# Altium project TLM_002_001.PrjPcb (part 1 of 2)
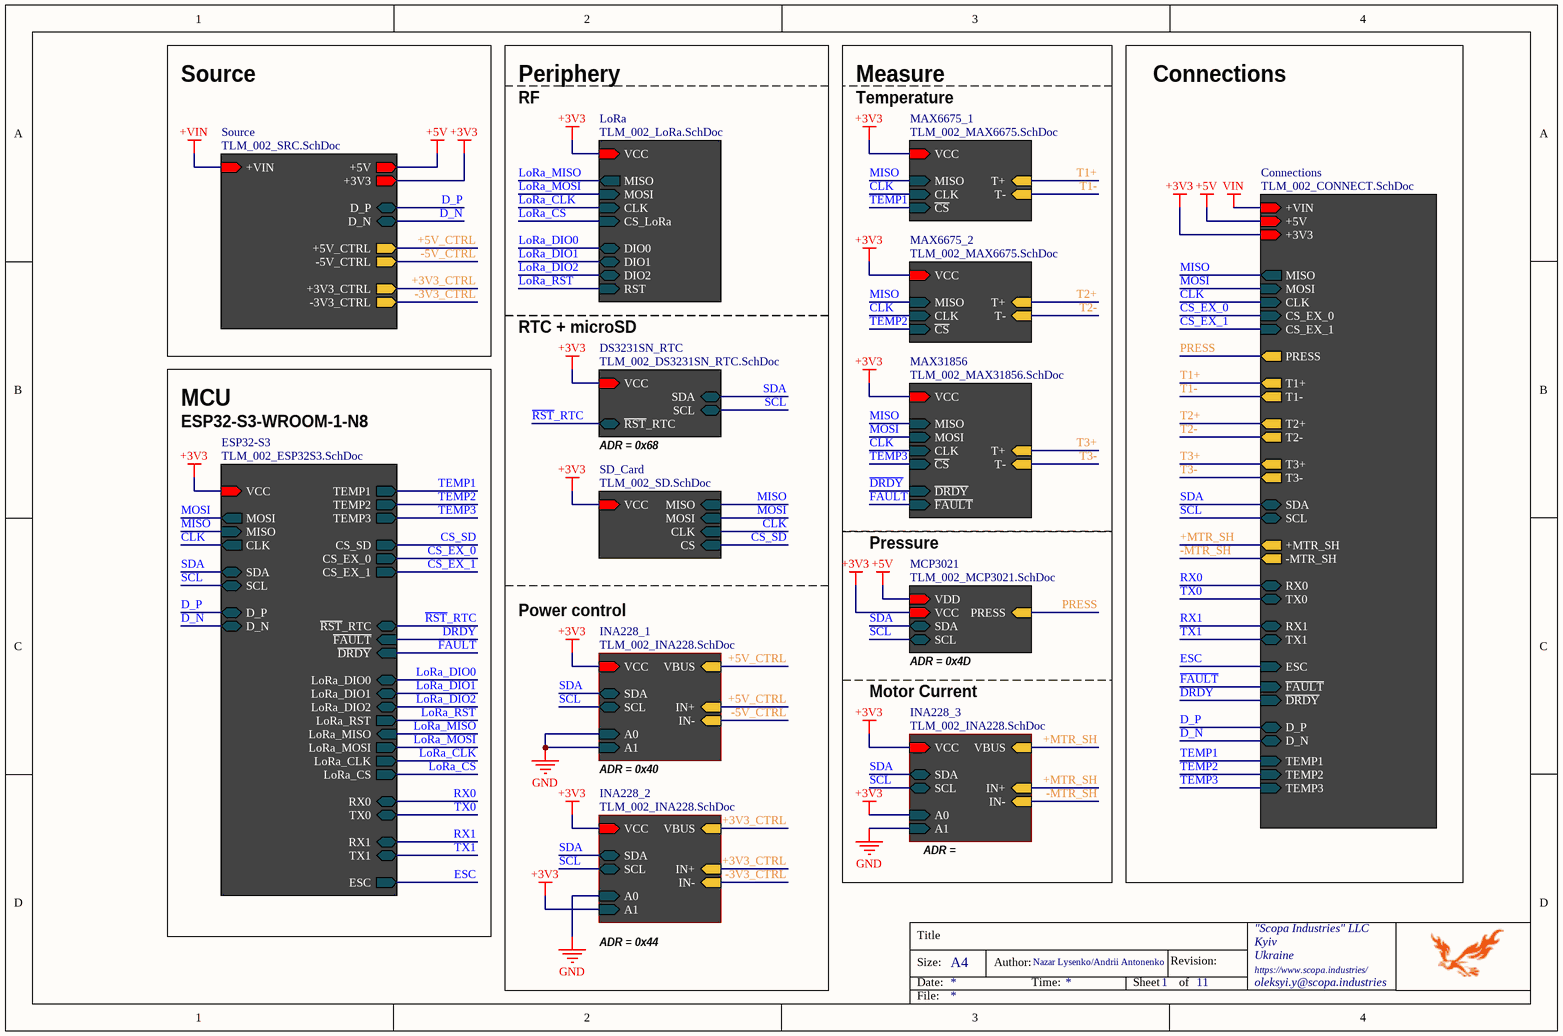
[diagram p0: TLM_002_MBR.SchDoc]
__Project_Template_Version: 1.0.3; _PCB_Order_Accuracy: 0.2mm / 8mil; _PCB_Order_BoardOutlineLayer: Mechanical1 (GM1); _PCB_Order_CastellatedHolesEdges: No; _PCB_Order_Cooper: 1oz / 35um; _PCB_Order_ElectricTest: Necessarily for 100% samples; _PCB_Order_Finish: HASL; _PCB_Order_LayersCnt: 2; _PCB_Order_Mask: on both sides; _PCB_Order_MaskColor: Black / White; _PCB_Order_Material: FR-4; _PCB_Order_MinHole: 0.3 mm; _PCB_Order_Silk: Yes; _PCB_Order_SilkColor: White / Black; _PCB_Order_Size: 0 x 0 mm; _PCB_Order_Thickness: 1.6 mm; Authors: Nazar Lysenko/Andrii Antonenko; Product_Name: TLM_002; Project_ID: 001; Project_Version: 1
11 sheets, 119 parts. Net scope: hierarchical (ports join the sheet entries above them; power ports are global).
Sheets:
  TLM_002_MBR.SchDoc
    MAX6675_1 = TLM_002_MAX6675.SchDoc
    MCP3021 = TLM_002_MCP3021.SchDoc
    INA228_3 = TLM_002_INA228.SchDoc
    ESP32-S3 = TLM_002_ESP32S3.SchDoc
    MAX31856 = TLM_002_MAX31856.SchDoc
    SD_Card = TLM_002_SD.SchDoc
    DS3231SN_RTC = TLM_002_DS3231SN_RTC.SchDoc
    MAX6675_2 = TLM_002_MAX6675.SchDoc
    INA228_2 = TLM_002_INA228.SchDoc
    INA228_1 = TLM_002_INA228.SchDoc
    Source = TLM_002_SRC.SchDoc
    LoRa = TLM_002_LoRa.SchDoc
    Connections = TLM_002_CONNECT.SchDoc

## Sheet TLM_002_MBR.SchDoc: =DocumentName
size A4; Author: Nazar Lysenko/Andrii Antonenko; CompanyName: "Scopa Industries" LLC; Engineer: Nazar Lysenko / Andrii Antonenko; Organization: "Scopa Industries" LLC; Address1: Kyiv; Address2: Ukraine; Address3: https://www.scopa.industries/; Address4: oleksyi.y@scopa.industries; Revision: 1; SheetNumber: 1; SheetTotal: 11

### Sub-sheets
Connections = TLM_002_CONNECT.SchDoc: +VIN (in), +5V (in), +3V3 (in), MISO (out), MOSI (in), CLK (in), CS_EX_0 (in), CS_EX_1 (in), PRESS (out), T1+ (out), T1- (out), T2+ (out), T2- (out), T3+ (out), T3- (out), SDA (bidir), SCL (bidir), +MTR_SH (out), -MTR_SH (out), RX0 (bidir), TX0 (bidir), RX1 (bidir), TX1 (bidir), ESC (in), ~{DRDY} (in), ~{FAULT} (in), D_N (bidir), D_P (bidir), TEMP1 (in), TEMP2 (in), TEMP3 (in)
DS3231SN_RTC = TLM_002_DS3231SN_RTC.SchDoc: VCC (in), SCL (bidir), SDA (bidir), ~{RST}_RTC (bidir)
ESP32-S3 = TLM_002_ESP32S3.SchDoc: MOSI (out), CLK (out), SCL (bidir), SDA (bidir), TEMP3 (out), TEMP2 (out), TEMP1 (out), VCC (in), ~{RST}_RTC (bidir), CS_SD (out), D_N (bidir), TX0 (bidir), RX0 (bidir), D_P (bidir), MISO (in), ~{DRDY} (in), ~{FAULT} (in), LoRa_RST (out), LoRa_DIO0 (bidir), LoRa_DIO1 (bidir), LoRa_DIO2 (bidir), LoRa_MOSI (out), LoRa_CLK (out), LoRa_CS (out), LoRa_MISO (in), TX1 (bidir), RX1 (bidir), ESC (out), CS_EX_1 (out), CS_EX_0 (out)
INA228_1 = TLM_002_INA228.SchDoc: SCL (bidir), SDA (bidir), A1 (in), A0 (in), IN- (in), IN+ (in), VCC (in), VBUS (in)
INA228_2 = TLM_002_INA228.SchDoc: SCL (bidir), SDA (bidir), A1 (in), A0 (in), IN- (in), IN+ (in), VCC (in), VBUS (in)
INA228_3 = TLM_002_INA228.SchDoc: SCL (bidir), SDA (bidir), A1 (in), A0 (in), IN- (in), IN+ (in), VCC (in), VBUS (in)
LoRa = TLM_002_LoRa.SchDoc: VCC (in), MOSI (in), CLK (in), MISO (out), CS_LoRa (in), RST (in), DIO0 (bidir), DIO1 (bidir), DIO2 (bidir)
MAX6675_1 = TLM_002_MAX6675.SchDoc: CLK (in), MISO (in), ~{CS} (in), T+ (in), T- (in), VCC (in)
MAX6675_2 = TLM_002_MAX6675.SchDoc: CLK (in), MISO (in), ~{CS} (in), T+ (in), T- (in), VCC (in)
MAX31856 = TLM_002_MAX31856.SchDoc: VCC (in), CLK (in), MISO (in), ~{CS} (in), MOSI (in), ~{DRDY} (in), ~{FAULT} (in), T+ (in), T- (in)
MCP3021 = TLM_002_MCP3021.SchDoc: SCL (bidir), SDA (bidir), VDD (in), PRESS (in), VCC (in)
SD_Card = TLM_002_SD.SchDoc: VCC (in), CLK (in), CS (in), MISO (in), MOSI (in)
Source = TLM_002_SRC.SchDoc: +VIN (in), D_P (bidir), D_N (bidir), +3V3 (out), +5V (out), -5V_CTRL (out), +5V_CTRL (out), -3V3_CTRL (out), +3V3_CTRL (out)

### Nets
+5V: sheet MCP3021/VDD, sheet INA228_1/IN-, sheet Source/+5V, sheet Source/-5V_CTRL, sheet Connections/+5V  [also labelled -5V_CTRL]
-3V3_CTRL: sheet MAX6675_1/VCC, sheet MCP3021/VCC, sheet INA228_3/A0, sheet INA228_3/VCC, sheet ESP32-S3/VCC, sheet MAX31856/VCC, sheet SD_Card/VCC, sheet DS3231SN_RTC/VCC, sheet MAX6675_2/VCC, sheet INA228_2/A1, sheet INA228_2/IN-, sheet INA228_2/VCC, sheet INA228_1/VCC, sheet Source/+3V3, sheet Source/-3V3_CTRL, sheet LoRa/VCC, sheet Connections/+3V3  [also labelled +3V3]
GND: sheet INA228_3/A1, sheet INA228_2/A0, sheet INA228_1/A1, sheet INA228_1/A0
+3V3_CTRL: sheet INA228_2/IN+, sheet INA228_2/VBUS, sheet Source/+3V3_CTRL
+5V_CTRL: sheet INA228_1/IN+, sheet INA228_1/VBUS, sheet Source/+5V_CTRL
+MTR_SH: sheet INA228_3/IN+, sheet INA228_3/VBUS, sheet Connections/+MTR_SH
-MTR_SH: sheet INA228_3/IN-, sheet Connections/-MTR_SH
CLK: sheet MAX6675_1/CLK, sheet ESP32-S3/CLK, sheet MAX31856/CLK, sheet SD_Card/CLK, sheet MAX6675_2/CLK, sheet Connections/CLK
CS_EX_0: sheet ESP32-S3/CS_EX_0, sheet Connections/CS_EX_0
CS_EX_1: sheet ESP32-S3/CS_EX_1, sheet Connections/CS_EX_1
CS_SD: sheet ESP32-S3/CS_SD, sheet SD_Card/CS
~{DRDY}: sheet ESP32-S3/~{FAULT}, sheet MAX31856/~{DRDY}, sheet Connections/~{DRDY}
D_N: sheet ESP32-S3/D_N, sheet Source/D_N, sheet Connections/D_N
D_P: sheet ESP32-S3/D_P, sheet Source/D_P, sheet Connections/D_P
ESC: sheet ESP32-S3/ESC, sheet Connections/ESC
~{FAULT}: sheet ESP32-S3/~{DRDY}, sheet MAX31856/~{FAULT}, sheet Connections/~{FAULT}
LoRa_CLK: sheet ESP32-S3/LoRa_CLK, sheet LoRa/CLK
LoRa_CS: sheet ESP32-S3/LoRa_CS, sheet LoRa/CS_LoRa
LoRa_DIO0: sheet ESP32-S3/LoRa_DIO0, sheet LoRa/DIO0
LoRa_DIO1: sheet ESP32-S3/LoRa_DIO1, sheet LoRa/DIO1
LoRa_DIO2: sheet ESP32-S3/LoRa_DIO2, sheet LoRa/DIO2
LoRa_MISO: sheet ESP32-S3/LoRa_MISO, sheet LoRa/MISO
LoRa_MOSI: sheet ESP32-S3/LoRa_MOSI, sheet LoRa/MOSI
LoRa_RST: sheet ESP32-S3/LoRa_RST, sheet LoRa/RST
MISO: sheet MAX6675_1/MISO, sheet ESP32-S3/MISO, sheet MAX31856/MISO, sheet SD_Card/MISO, sheet MAX6675_2/MISO, sheet Connections/MISO
MOSI: sheet ESP32-S3/MOSI, sheet MAX31856/MOSI, sheet SD_Card/MOSI, sheet Connections/MOSI
PRESS: sheet MCP3021/PRESS, sheet Connections/PRESS
~{RST}_RTC: sheet ESP32-S3/~{RST}_RTC, sheet DS3231SN_RTC/~{RST}_RTC
RX0: sheet ESP32-S3/RX0, sheet Connections/RX0
RX1: sheet ESP32-S3/RX1, sheet Connections/RX1
SCL: sheet MCP3021/SCL, sheet INA228_3/SCL, sheet ESP32-S3/SCL, sheet DS3231SN_RTC/SCL, sheet INA228_2/SCL, sheet INA228_1/SCL, sheet Connections/SCL
SDA: sheet MCP3021/SDA, sheet INA228_3/SDA, sheet ESP32-S3/SDA, sheet DS3231SN_RTC/SDA, sheet INA228_2/SDA, sheet INA228_1/SDA, sheet Connections/SDA
T1+: sheet MAX6675_1/T+, sheet Connections/T1+
T1-: sheet MAX6675_1/T-, sheet Connections/T1-
T2+: sheet MAX6675_2/T+, sheet Connections/T2+
T2-: sheet MAX6675_2/T-, sheet Connections/T2-
T3+: sheet MAX31856/T+, sheet Connections/T3+
T3-: sheet MAX31856/T-, sheet Connections/T3-
TEMP1: sheet MAX6675_1/~{CS}, sheet ESP32-S3/TEMP1, sheet Connections/TEMP1
TEMP2: sheet ESP32-S3/TEMP2, sheet MAX6675_2/~{CS}, sheet Connections/TEMP2
TEMP3: sheet ESP32-S3/TEMP3, sheet MAX31856/~{CS}, sheet Connections/TEMP3
TX0: sheet ESP32-S3/TX0, sheet Connections/TX0
TX1: sheet ESP32-S3/TX1, sheet Connections/TX1

### Notes on the sheet
- Source
- Periphery
- RF
- Measure
- Temperature
- Connections
- RTC + microSD
- MCU
- ESP32-S3-WROOM-1-N8
- ADR = 0x68
- Pressure
- Power control
- Motor Current
- ADR = 0x4D
- ADR = 0x40
- ADR = 0x41
- ADR = 0x44
- Title
- Size:
- Date:
- A4
- Author:
- Time:
- Sheet
- Revision:
- of
- File:

## Sheet TLM_002_MAX6675.SchDoc: =DocumentName
size A4; CompanyName: Scopa Industries LLC; Engineer: Nazar Lysenko / Andrii Antonenko; Organization: Scopa Industries LLC; Address1: Kyiv; Address2: Ukraine; Address3: https://www.scopa.industries/; Address4: oleksyi.y@scopa.industries; Revision: 1; SheetNumber: 3; SheetTotal: 11
Used 2 times, as channels MAX6675_1, MAX6675_2. Parts and nets are listed once, with the designators drawn on the sheet.
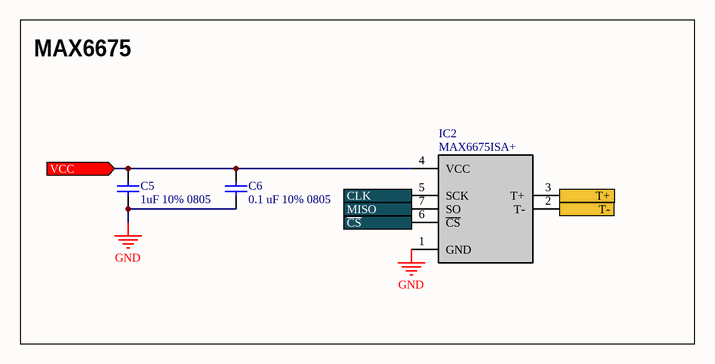
[diagram p1: TLM_002_MAX6675.SchDoc]

### Parts
C5  1uF 10% 0805  [CAPC2013X145X50NL20T20]
C6  0.1 uF 10% 0805  [CAPC2013X140X50ML20T25]
IC2  MAX6675ISA+  [SOIC127P600X175-8N]

### Ports
CLK (in, see TLM_002_MBR[3A], TLM_002_CONNECT[1B], TLM_002_ESP32S3[2B], TLM_002_MAX31856[2B], TLM_002_SD[3B]), MISO (out, see TLM_002_MBR[3A], TLM_002_CONNECT[1A], TLM_002_ESP32S3[3B], TLM_002_MAX31856[2B], TLM_002_SD[3B]), T+ (in, see TLM_002_MBR[3A]), T- (in, see TLM_002_MBR[3A]), VCC (in, see TLM_002_MBR[3A], TLM_002_DS3231SN_RTC[2B], TLM_002_ESP32S3[1A], TLM_002_INA228[1B], TLM_002_LoRa[2B], TLM_002_MAX31856[1B], TLM_002_SD[1B]), ~{CS} (in, see TLM_002_MBR[3A])

### Nets
GND: C5.1 C6.1 IC2.1(GND)
~{CS}: IC2.6(~{CS}) ; port ~{CS}
CLK: IC2.5(SCK) ; port CLK
MISO: IC2.7(SO) ; port MISO
T+: IC2.3(T+) ; port T+
T-: IC2.2(T-) ; port T-
VCC: C5.2 C6.2 IC2.4(VCC) ; port VCC

### Channels
MAX6675_1: designators end in _MAX6675_1; ports CLK=CLK MISO=MISO T+=T1+ T-=T1- VCC=-3V3_CTRL ~{CS}=TEMP1
MAX6675_2: designators end in _MAX6675_2; ports CLK=CLK MISO=MISO T+=T2+ T-=T2- VCC=-3V3_CTRL ~{CS}=TEMP2

### Notes on the sheet
- MAX6675
- Title
- Size:
- Date:
- A4
- Author:
- Time:
- Sheet
- Revision:
- of
- File:

### Library data of the parts
C5 = CMP-2007-01676-1: Part Number: VJ0805Y105KXQRW1BC; Manufacturer: Vitramon
C6 = CMP-2007-04651-1: Part Number: 0805DD104KAT2A; Manufacturer: AVX Interconnect / Elco
IC2 = MAX6675ISA+: Integrated Circuit; Manufacturer_Name: Analog Devices; Datasheet Link: http://datasheets.maximintegrated.com/en/ds/MAX6675.pdf; Height: 1.75mm; Manufacturer_Part_Number: MAX6675ISA+; Mouser Part Number: 700-MAX6675ISA; Mouser Price/Stock: https://www.mouser.co.uk/ProductDetail/Analog-Devices-Maxim-Integrated/MAX6675ISA%2b?qs=1THa7WoU59H74vpgspkIMw%3D%3D; Arrow Part Number: MAX6675ISA+; Arrow Price/Stock: https://www.arrow.com/en/products/max6675isa/analog-devices?utm_currency=USD&region=nac

## Sheet TLM_002_MCP3021.SchDoc: =DocumentName
size A4; Author: Nazar Lysenko/Andrii Antonenko; CompanyName: Scopa Industries LLC; Engineer: Nazar Lysenko / Andrii Antonenko; Organization: Scopa Industries LLC; Address1: Kyiv; Address2: Ukraine; Address3: https://www.scopa.industries/; Address4: oleksyi.y@scopa.industries; Revision: 1; SheetNumber: 8; SheetTotal: 11
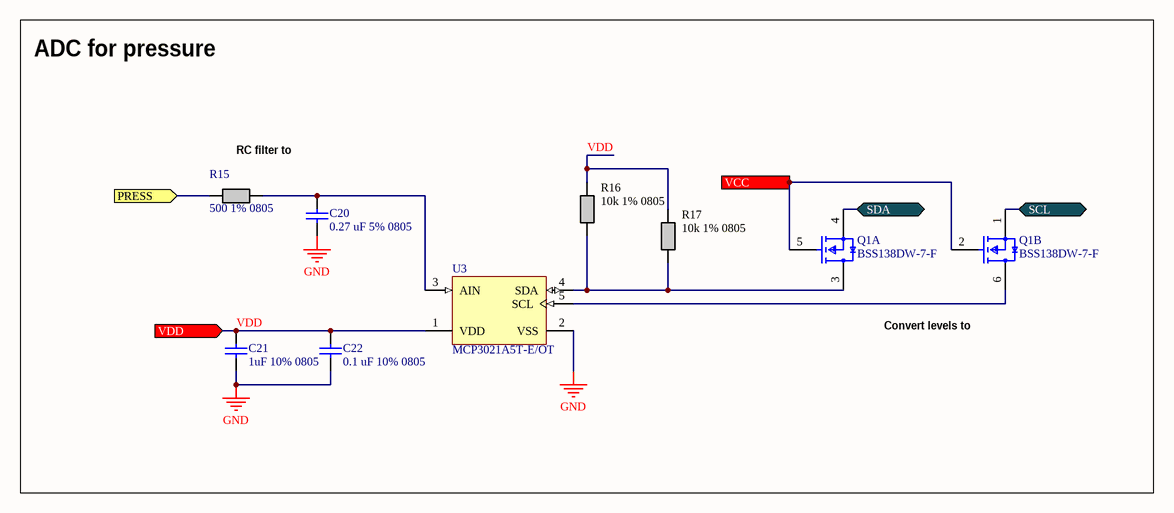
[diagram p2: TLM_002_MCP3021.SchDoc]

### Parts
C20  0.27 uF 5% 0805  [CAPC2013X145X50ML20T20]
C21  1uF 10% 0805  [CAPC2013X145X50NL20T20]
C22  0.1 uF 10% 0805  [CAPC2013X140X50ML20T25]
Q1  BSS138DW-7-F  [FP-SOT363-IPC_B]  (parts A,B of 2)
R15  500 1% 0805  [RES_0805]
R16  10k 1% 0805  [RES_0805]
R17  10k 1% 0805  [RES_0805]
U3  MCP3021A5T-E/OT  [SOT-23-OT5_L]

### Ports
PRESS (in, see TLM_002_MBR[3C], TLM_002_CONNECT[1C]), SCL (bidir, see TLM_002_MBR[3C], TLM_002_CONNECT[1B], TLM_002_DS3231SN_RTC[2B], TLM_002_ESP32S3[2B], TLM_002_INA228[2B]), SDA (bidir, see TLM_002_MBR[3C], TLM_002_CONNECT[1B], TLM_002_DS3231SN_RTC[2B], TLM_002_ESP32S3[2B], TLM_002_INA228[2B]), VCC (in, see TLM_002_MBR[3C], TLM_002_DS3231SN_RTC[2B], TLM_002_ESP32S3[1A], TLM_002_INA228[1B], TLM_002_LoRa[2B], TLM_002_MAX6675[2B], TLM_002_MAX31856[1B], TLM_002_SD[1B]), VDD (in, see TLM_002_MBR[3C])

### Nets
-3V3_CTRL: Q1.2(G2) Q1.5(G1) ; port VCC
GND: C20.1 C21.1 C22.1 U3.2(VSS)
VDD: C21.2 C22.2 R16.1 R17.1 U3.1(VDD) ; port VDD  [project net +5V]
PRESS: R15.1 ; port PRESS
SCL: Q1.1(S2) ; port SCL
SDA: Q1.4(S1) ; port SDA
NetC20_2: C20.2 R15.2 U3.3(AIN)
NetQ1_3: Q1.3(D1) R16.2 R17.2 U3.4(SDA)
NetQ1_6: Q1.6(D2) U3.5(SCL)

### Notes on the sheet
- ADC for pressure sensor
- RC filter to 1kHz
- Convert levels to 3V3
- Title
- Size:
- Date:
- A4
- Author:
- Time:
- Sheet
- Revision:
- of
- File:

### Library data of the parts
C20 = CMP-2007-01595-1: Part Number: VJ0805Y274JXXTW1BC; Manufacturer: Vitramon
C21 = CMP-2007-01676-1: as C5 on sheet TLM_002_MAX6675
C22 = CMP-2007-04651-1: as C6 on sheet TLM_002_MAX6675
Q1 = CMP-2000-05966-3: MOSFET 2N-CH 50V 0.2A SC70-6; Drain to Source Resistance: 3.5R; Current Rating: 200mA; Number of Channels: 2; Element Configuration: Dual; Threshold Voltage: 1.2V; Power Dissipation: 200mW; Turn-On Delay Time: 20ns; FET Type: 2 N-Channel; Gate to Source Voltage (Vgs): 20V; Input Capacitance: 50pF; Max Operating Temperature: 150°C; Number of Terminals: 6; Mount: Surface Mount; Number of Pins: 6; Packaging: Tape and Reel; Min Breakdown Voltage: 50V; REACH SVHC: No SVHC; Contact Plating: Tin; Min Operating Temperature: -55°C; Drain to Source Voltage (Vdss): 50V; Case/Package: SOT-363; On-State Resistance: 3.5R; Height: 1mm; Continuous Drain Current (ID): 200mA; Turn-Off Delay Time: 20ns; Lead Free: Lead Free; Number of Elements: 2; Max Power Dissipation: 200mW; Width: 1.35mm; Package Quantity: 3000; Length: 2.2mm; Drain to Source Breakdown Voltage: 50V; Voltage Rating (DC): 50V; Nominal Vgs: 1.2V; Rds On Max: 3.5R; Weight: 0.000212oz
R15 = Resistor_500: Resistor 500Ohm 1% SMD 0805 Generic; Value: 500; Package size: 0805; Tolerance: 1%
R16 R17 = Resistor_10k: Resistor 10kOhm 1% SMD 0805 Generic; Package size: 0805; Tolerance: 1%; Value: 10k
U3 = CMP-0188-00725-2: Low Power 10-Bit A/D Converter With I2C Interface, 5-Pin SOT-23, Extended Temperature, Tape and Reel; PackageVersion: revBB, Aug-2009; ComponentLink1Description: Manufacturer URL; PackageReference: SOT-23-OT5; DatasheetVersion: revA, May-2003; RevisionNote: URLs added.; ComponentLink2URL: http://ww1.microchip.com/downloads/en/DeviceDoc/21805a.pdf; Code_IPC: SOT23-5; ComponentLink1URL: http://www.microchip.com/; ComponentLink3URL: http://www.microchip.com/stellent/groups/techpub_sg/documents/packagingspec/en012702.pdf; ComponentLink3Description: Package Specification; PackageDescription: 5-Lead Plastic Small Outline Transistor (OT) [SOT-23]; ComponentLink2Description: Datasheet

## Sheet TLM_002_INA228.SchDoc: =DocumentName
size A4; Author: Nazar Lysenko/Andrii Antonenko; CompanyName: Scopa Industries LLC; Engineer: Nazar Lysenko / Andrii Antonenko; Organization: Scopa Industries LLC; Address1: Kyiv; Address2: Ukraine; Address3: https://www.scopa.industries/; Address4: oleksyi.y@scopa.industries; Revision: 1; SheetNumber: 5; SheetTotal: 11
Used 3 times, as channels INA228_3, INA228_2, INA228_1. Parts and nets are listed once, with the designators drawn on the sheet.
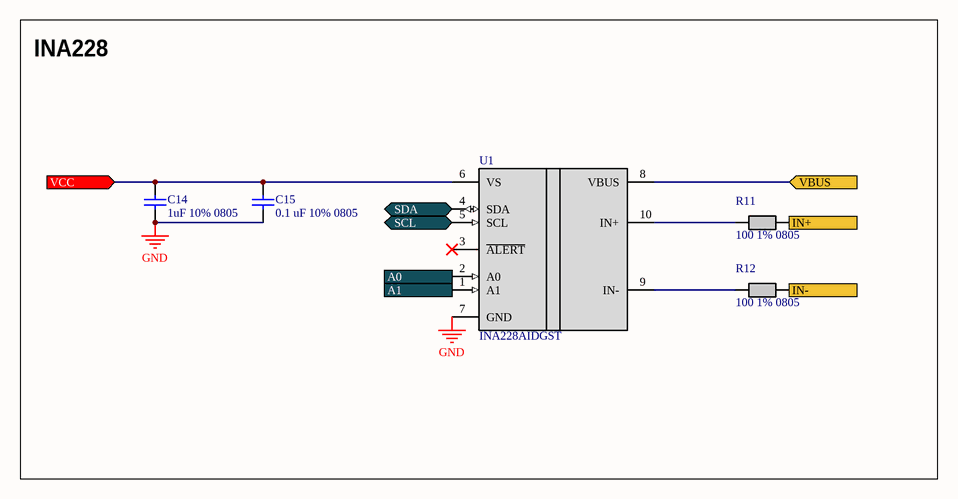
[diagram p3: TLM_002_INA228.SchDoc]

### Parts
C14  1uF 10% 0805  [CAPC2013X145X50NL20T20]
C15  0.1 uF 10% 0805  [CAPC2013X140X50ML20T25]
R11  100 1% 0805  [RES_0805]
R12  100 1% 0805  [RES_0805]
U1  INA228AIDGST  [FP-DGS0010A-IPC_C]

### Ports
A0 (in, see TLM_002_MBR[2C]), A1 (in, see TLM_002_MBR[2C]), IN+ (in, see TLM_002_MBR[2C]), IN- (in, see TLM_002_MBR[2C]), SCL (bidir, see TLM_002_MBR[2C], TLM_002_CONNECT[1B], TLM_002_DS3231SN_RTC[2B], TLM_002_ESP32S3[2B], TLM_002_MCP3021[4B]), SDA (bidir, see TLM_002_MBR[2C], TLM_002_CONNECT[1B], TLM_002_DS3231SN_RTC[2B], TLM_002_ESP32S3[2B], TLM_002_MCP3021[3B]), VBUS (in, see TLM_002_MBR[2C]), VCC (in, see TLM_002_MBR[2C], TLM_002_DS3231SN_RTC[2B], TLM_002_ESP32S3[1A], TLM_002_LoRa[2B], TLM_002_MAX6675[2B], TLM_002_MAX31856[1B], TLM_002_MCP3021[3B], TLM_002_SD[1B])

### Nets
GND: C14.1 C15.1 U1.7(GND)
A0: U1.2(A0) ; port A0
A1: U1.1(A1) ; port A1
IN+: R11.2 ; port IN+
IN-: R12.2 ; port IN-
SCL: U1.5(SCL) ; port SCL
SDA: U1.4(SDA) ; port SDA
VBUS: U1.8(VBUS) ; port VBUS
VCC: C14.2 C15.2 U1.6(VS) ; port VCC
NetR11_1: R11.1 U1.10(IN+)
NetR12_1: R12.1 U1.9(IN-)

Not connected (* = marked no-connect by the designer): U1 3(~{ALERT})*

### Channels
INA228_3: designators end in _INA228_3; ports A0=-3V3_CTRL A1=GND IN+=+MTR_SH IN-=-MTR_SH SCL=SCL SDA=SDA VBUS=+MTR_SH VCC=-3V3_CTRL
INA228_2: designators end in _INA228_2; ports A0=GND A1=-3V3_CTRL IN+=+3V3_CTRL IN-=-3V3_CTRL SCL=SCL SDA=SDA VBUS=+3V3_CTRL VCC=-3V3_CTRL
INA228_1: designators end in _INA228_1; ports A0=GND A1=GND IN+=+5V_CTRL IN-=+5V SCL=SCL SDA=SDA VBUS=+5V_CTRL VCC=-3V3_CTRL

### Notes on the sheet
- INA228
- Title
- Size:
- Date:
- A4
- Author:
- Time:
- Sheet
- Revision:
- of
- File:

### Library data of the parts
C14 = CMP-2007-01676-1: as C5 on sheet TLM_002_MAX6675
C15 = CMP-2007-04651-1: as C6 on sheet TLM_002_MAX6675
R11 R12 = Resistor_100: Resistor 100Ohm 1% SMD 0805 Generic; Value: 100; Package size: 0805; Tolerance: 1%
U1 = CMP-019-00049-1: IC PWR MONITOR 10VSSOP Power Supply Controller Digital Power Monitor 10-VSSOP

## Sheet TLM_002_ESP32S3.SchDoc: =DocumentName
size A4; Author: Nazar Lysenko/Andrii Antonenko; CompanyName: Scopa Industries LLC; Engineer: Nazar Lysenko / Andrii Antonenko; Organization: Scopa Industries LLC; Address1: Kyiv; Address2: Ukraine; Address3: https://www.scopa.industries/; Address4: oleksyi.y@scopa.industries; Revision: 1; SheetNumber: 2; SheetTotal: 11
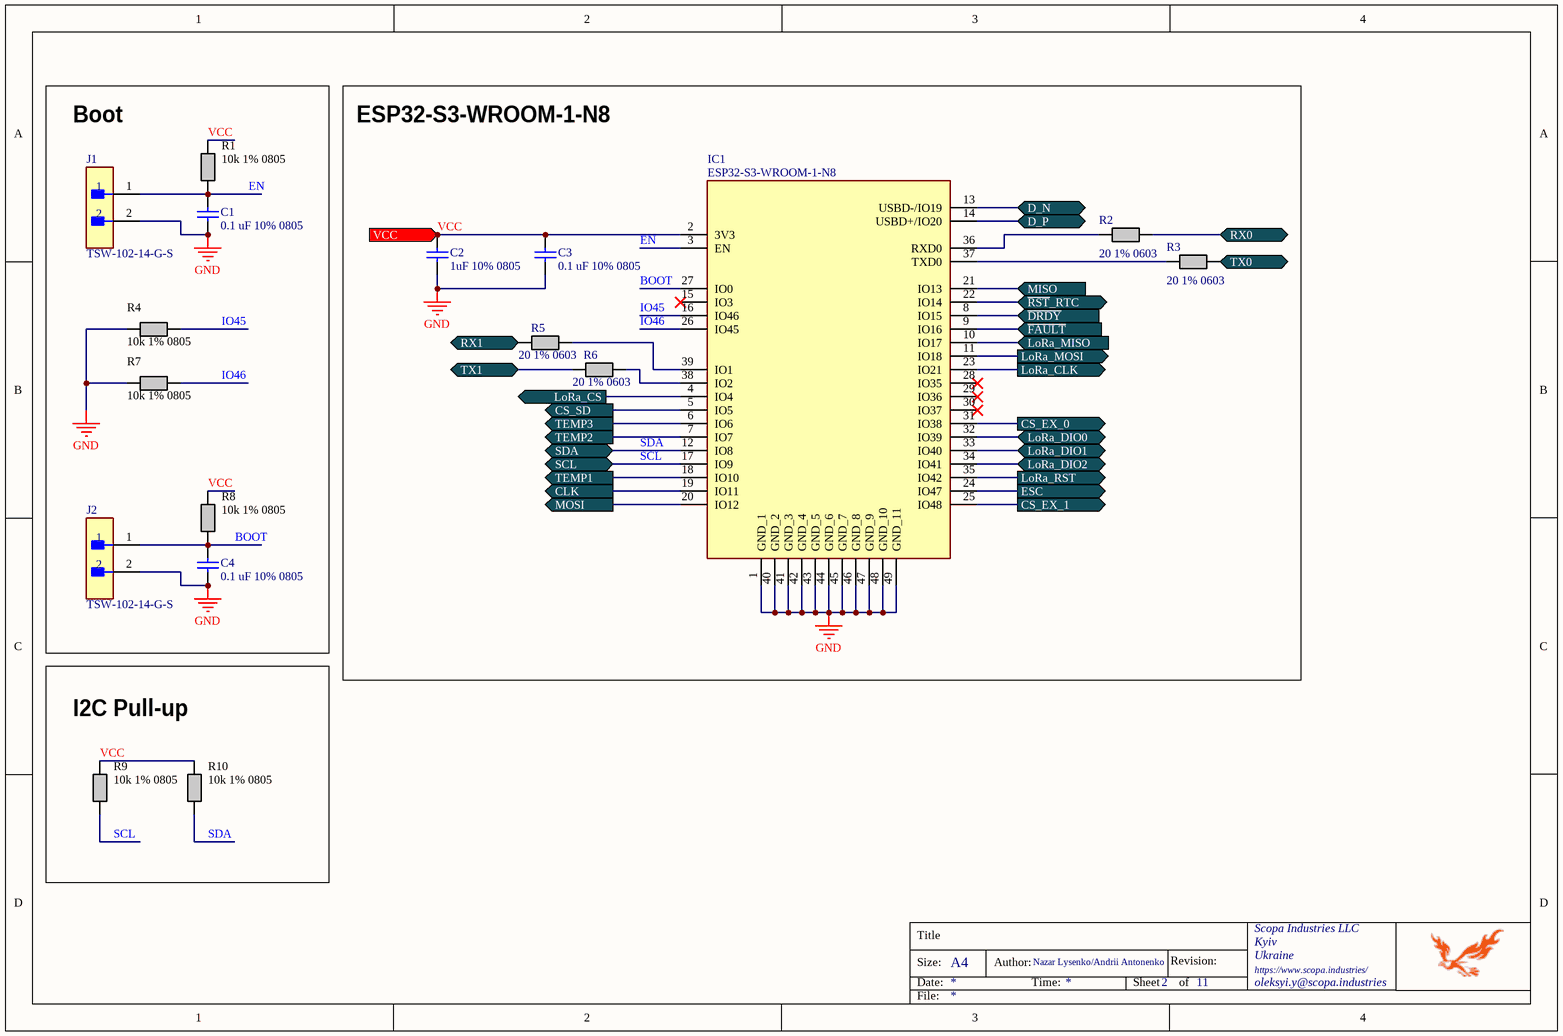
[diagram p4: TLM_002_ESP32S3.SchDoc]

### Parts
C1  0.1 uF 10% 0805  [CAPC2013X140X50ML20T25]
C2  1uF 10% 0805  [CAPC2013X145X50NL20T20]
C3  0.1 uF 10% 0805  [CAPC2013X140X50ML20T25]
C4  0.1 uF 10% 0805  [CAPC2013X140X50ML20T25]
IC1  ESP32-S3-WROOM-1-N8  [ESP32S3WROOM1N8R2]
J1  TSW-102-14-G-S  [FP-TSW-102-14-G-S-MFG]
J2  TSW-102-14-G-S  [FP-TSW-102-14-G-S-MFG]
R1  10k 1% 0805  [RES_0805]
R2  20 1% 0603  [RES_0603]
R3  20 1% 0603  [RES_0603]
R4  10k 1% 0805  [RES_0805]
R5  20 1% 0603  [RES_0603]
R6  20 1% 0603  [RES_0603]
R7  10k 1% 0805  [RES_0805]
R8  10k 1% 0805  [RES_0805]
R9  10k 1% 0805  [RES_0805]
R10  10k 1% 0805  [RES_0805]

### Ports
CLK (out, see TLM_002_MBR[1C], TLM_002_CONNECT[1B], TLM_002_MAX6675[2B], TLM_002_MAX31856[2B], TLM_002_SD[3B]), CS_EX_0 (out, see TLM_002_MBR[2C], TLM_002_CONNECT[1B]), CS_EX_1 (out, see TLM_002_MBR[2C], TLM_002_CONNECT[1B]), CS_SD (out, see TLM_002_MBR[2C]), D_N (bidir, see TLM_002_MBR[1C], TLM_002_CONNECT[1B], TLM_002_SRC[2C]), D_P (bidir, see TLM_002_MBR[1C], TLM_002_CONNECT[1B], TLM_002_SRC[2C]), ESC (out, see TLM_002_MBR[2D], TLM_002_CONNECT[4A]), LoRa_CLK (out, see TLM_002_MBR[2C]), LoRa_CS (out, see TLM_002_MBR[2D]), LoRa_DIO0 (bidir, see TLM_002_MBR[2C]), LoRa_DIO1 (bidir, see TLM_002_MBR[2C]), LoRa_DIO2 (bidir, see TLM_002_MBR[2C]), LoRa_MISO (in, see TLM_002_MBR[2C]), LoRa_MOSI (out, see TLM_002_MBR[2C]), LoRa_RST (out, see TLM_002_MBR[2C]), MISO (in, see TLM_002_MBR[1C], TLM_002_CONNECT[1A], TLM_002_MAX6675[2B], TLM_002_MAX31856[2B], TLM_002_SD[3B]), MOSI (out, see TLM_002_MBR[1C], TLM_002_CONNECT[1A], TLM_002_MAX31856[2B], TLM_002_SD[3B]), RX0 (bidir, see TLM_002_MBR[2D], TLM_002_CONNECT[1B]), RX1 (bidir, see TLM_002_MBR[2D], TLM_002_CONNECT[1B]), SCL (bidir, see TLM_002_MBR[1C], TLM_002_CONNECT[1B], TLM_002_DS3231SN_RTC[2B], TLM_002_INA228[2B], TLM_002_MCP3021[4B]), SDA (bidir, see TLM_002_MBR[1C], TLM_002_CONNECT[1B], TLM_002_DS3231SN_RTC[2B], TLM_002_INA228[2B], TLM_002_MCP3021[3B]), TEMP1 (out, see TLM_002_MBR[2B], TLM_002_CONNECT[1B]), TEMP2 (out, see TLM_002_MBR[2B], TLM_002_CONNECT[1B]), TEMP3 (out, see TLM_002_MBR[2C], TLM_002_CONNECT[1B]), TX0 (bidir, see TLM_002_MBR[2D], TLM_002_CONNECT[1B]), TX1 (bidir, see TLM_002_MBR[2D], TLM_002_CONNECT[1B]), VCC (in, see TLM_002_MBR[1B], TLM_002_DS3231SN_RTC[2B], TLM_002_INA228[1B], TLM_002_LoRa[2B], TLM_002_MAX6675[2B], TLM_002_MAX31856[1B], TLM_002_MCP3021[3B], TLM_002_SD[1B]), ~{DRDY} (in, see TLM_002_MBR[2C]), ~{FAULT} (in, see TLM_002_MBR[2C]), ~{RST}_RTC (bidir, see TLM_002_MBR[2C], TLM_002_DS3231SN_RTC[3B])

### Nets
GND: C1.1 C2.1 C3.1 C4.1 IC1.1(GND_1) IC1.40(GND_2) IC1.41(GND_3) IC1.42(GND_4) IC1.43(GND_5) IC1.44(GND_6) IC1.45(GND_7) IC1.46(GND_8) IC1.47(GND_9) IC1.48(GND_10) IC1.49(GND_11) J1.2 J2.2 R4.1 R7.1
VCC: C2.2 C3.2 IC1.2(3V3) R1.1 R8.1 R9.1 R10.1 ; port VCC  [project net -3V3_CTRL]
BOOT: C4.2 IC1.27(IO0) J2.1 R8.2
CLK: IC1.19(IO11) ; port CLK
CS_EX_0: IC1.31(IO38) ; port CS_EX_0
CS_EX_1: IC1.25(IO48) ; port CS_EX_1
CS_SD: IC1.5(IO5) ; port CS_SD
~{DRDY}: IC1.9(IO16) ; port ~{FAULT}
D_N: IC1.13(USBD-/IO19) ; port D_N
D_P: IC1.14(USBD+/IO20) ; port D_P
EN: C1.2 IC1.3(EN) J1.1 R1.2
ESC: IC1.24(IO47) ; port ESC
~{FAULT}: IC1.8(IO15) ; port ~{DRDY}
IO45: IC1.16(IO46) R4.2
IO46: IC1.26(IO45) R7.2
LoRa_CLK: IC1.23(IO21) ; port LoRa_CLK
LoRa_CS: IC1.4(IO4) ; port LoRa_CS
LoRa_DIO0: IC1.32(IO39) ; port LoRa_DIO0
LoRa_DIO1: IC1.33(IO40) ; port LoRa_DIO1
LoRa_DIO2: IC1.34(IO41) ; port LoRa_DIO2
LoRa_MISO: IC1.10(IO17) ; port LoRa_MISO
LoRa_MOSI: IC1.11(IO18) ; port LoRa_MOSI
LoRa_RST: IC1.35(IO42) ; port LoRa_RST
MISO: IC1.21(IO13) ; port MISO
MOSI: IC1.20(IO12) ; port MOSI
~{RST}_RTC: IC1.22(IO14) ; port ~{RST}_RTC
RX0: R2.2 ; port RX0
RX1: R5.1 ; port RX1
SCL: IC1.17(IO9) R9.2 ; port SCL
SDA: IC1.12(IO8) R10.2 ; port SDA
TEMP1: IC1.18(IO10) ; port TEMP1
TEMP2: IC1.7(IO7) ; port TEMP2
TEMP3: IC1.6(IO6) ; port TEMP3
TX0: R3.2 ; port TX0
TX1: R6.1 ; port TX1
NetIC1_36: IC1.36(RXD0) R2.1
NetIC1_37: IC1.37(TXD0) R3.1
NetIC1_38: IC1.38(IO2) R6.2
NetIC1_39: IC1.39(IO1) R5.2

Not connected (* = marked no-connect by the designer): IC1 15(IO3)* 28(IO35)* 29(IO36)* 30(IO37)*

### Notes on the sheet
- (near R1) Boot configuration
- ESP32-S3-WROOM-1-N8
- I2C Pull-up
- Title
- Size:
- Date:
- A4
- Author:
- Time:
- Sheet
- Revision:
- of
- File:

### Library data of the parts
C1 C3 C4 = CMP-2007-04651-1: as C6 on sheet TLM_002_MAX6675
C2 = CMP-2007-01676-1: as C5 on sheet TLM_002_MAX6675
IC1 = ESP32-S3-WROOM-1-N8: Integrated Circuit; Manufacturer_Name: Espressif Systems; Datasheet Link: https://www.espressif.com/sites/default/files/documentation/esp32-s3-wroom-1_wroom-1u_datasheet_en.pdf; Height: 3.25mm; Manufacturer_Part_Number: ESP32-S3-WROOM-1-N8; Mouser Part Number: 356-ESP32-S3WROOM1N8; Mouser Price/Stock: https://www.mouser.co.uk/ProductDetail/Espressif-Systems/ESP32-S3-WROOM-1-N8?qs=Wj%2FVkw3K%252BMC1mq0KGPvoSQ%3D%3D
J1 J2 = CMP-02766-001740-1: CONN HEADER VERT 2POS 2.54MM; Number of Positions: 2; Max Current Rating: 7.6A; Gender: Male; Max Voltage Rating (AC): 550V; Contact Mating Length: 0.32inch; REACH SVHC: No SVHC; Width: 2.54mm; Insulation Material: PBT; Contact Shape: Square; Contact Plating: Gold; Min Operating Temperature: -55°C; Contact Material: Bronze; Color: Black; Number of Contacts: 2; Housing Material: Polyester; Orientation: Straight; Flammability Rating: UL94 V-0; Max Operating Temperature: 125°C; Contact Type: Male Pin; Radiation Hardening: No; Termination: Solder; RoHS Compliant: Yes; Lead Free: Lead Free; Fastening Type: Pull; Pitch: 2.54mm; Number of Rows: 1; Series: TSW; Insulation Color: Black; Package Quantity: 1; Connector Type: Header; Length: 5.08mm; Contact Finish - Mating: GOLD; Mount: Through Hole; Housing Color: Black; Depth: 2.54mm; Packaging: Bulk
R1 R4 R7-R10 = Resistor_10k: Resistor 10kOhm 1% SMD 0805 Generic; Package size: 0805; Tolerance: 1%; Value: 10k
R2 R3 R5 R6 = Resistor_20: Resistor 20Ohm 1% SMD 0603 Generic; Value: 20; Package size: 0805; Tolerance: 1%

## Sheet TLM_002_MAX31856.SchDoc: =DocumentName
size A4; Author: Nazar Lysenko/Andrii Antonenko; CompanyName: Scopa Industries LLC; Engineer: Nazar Lysenko / Andrii Antonenko; Organization: Scopa Industries LLC; Address1: Kyiv; Address2: Ukraine; Address3: https://www.scopa.industries/; Address4: oleksyi.y@scopa.industries; Revision: 1; SheetNumber: 4; SheetTotal: 11
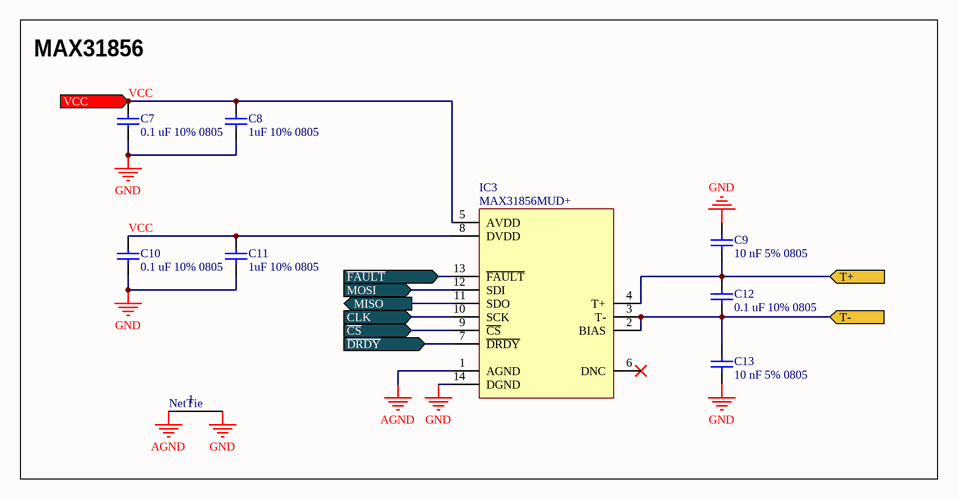
[diagram p5: TLM_002_MAX31856.SchDoc]

### Parts
1  NetTie  [NetTie]  (net tie, no BOM)
C7  0.1 uF 10% 0805  [CAPC2013X140X50ML20T25]
C8  1uF 10% 0805  [CAPC2013X145X50NL20T20]
C9  10 nF 5% 0805  [CAPC2013X94X50LL20T25]
C10  0.1 uF 10% 0805  [CAPC2013X140X50ML20T25]
C11  1uF 10% 0805  [CAPC2013X145X50NL20T20]
C12  0.1 uF 10% 0805  [CAPC2013X140X50ML20T25]
C13  10 nF 5% 0805  [CAPC2013X94X50LL20T25]
IC3  MAX31856MUD+  [SOP65P640X110-14N]

### Ports
CLK (in, see TLM_002_MBR[3B], TLM_002_CONNECT[1B], TLM_002_ESP32S3[2B], TLM_002_MAX6675[2B], TLM_002_SD[3B]), MISO (out, see TLM_002_MBR[3B], TLM_002_CONNECT[1A], TLM_002_ESP32S3[3B], TLM_002_MAX6675[2B], TLM_002_SD[3B]), MOSI (in, see TLM_002_MBR[3B], TLM_002_CONNECT[1A], TLM_002_ESP32S3[2B], TLM_002_SD[3B]), T+ (in, see TLM_002_MBR[3B]), T- (in, see TLM_002_MBR[3B]), VCC (in, see TLM_002_MBR[3B], TLM_002_DS3231SN_RTC[2B], TLM_002_ESP32S3[1A], TLM_002_INA228[1B], TLM_002_LoRa[2B], TLM_002_MAX6675[2B], TLM_002_MCP3021[3B], TLM_002_SD[1B]), ~{CS} (in, see TLM_002_MBR[3B]), ~{DRDY} (in, see TLM_002_MBR[3B]), ~{FAULT} (in, see TLM_002_MBR[3B])

### Nets
AGND: 1.1 IC3.1(AGND)
GND: 1.2 C7.1 C8.1 C9.2 C10.1 C11.1 C13.1 IC3.14(DGND)
VCC: C7.2 C8.2 C10.2 C11.2 IC3.5(AVDD) IC3.8(DVDD) ; port VCC  [project net -3V3_CTRL]
CLK: IC3.10(SCK) ; port CLK
~{DRDY}: IC3.7(~{DRDY}) ; port ~{DRDY}
~{FAULT}: IC3.13(~{FAULT}) ; port ~{FAULT}
MISO: IC3.11(SDO) ; port MISO
MOSI: IC3.12(SDI) ; port MOSI
T3+: C9.1 C12.2 IC3.4(T+) ; port T+
T3-: C12.1 C13.2 IC3.2(BIAS) IC3.3(T-) ; port T-
TEMP3: IC3.9(~{CS}) ; port ~{CS}

Not connected (* = marked no-connect by the designer): IC3 6(DNC)*

### Notes on the sheet
- MAX31856
- Title
- Size:
- Date:
- A4
- Author:
- Time:
- Sheet
- Revision:
- of
- File:

### Library data of the parts
C7 C10 C12 = CMP-2007-04651-1: as C6 on sheet TLM_002_MAX6675
C8 C11 = CMP-2007-01676-1: as C5 on sheet TLM_002_MAX6675
C9 C13 = CMP-2007-04234-1: Manufacturer: AVX Interconnect / Elco; Part Number: 08053C103JAT2A
IC3 = MAX31856MUD+: Integrated Circuit; Manufacturer_Name: Analog Devices; Datasheet Link: https://componentsearchengine.com/Datasheets/2/MAX31856MUD+.pdf; Height: 1.1mm; Manufacturer_Part_Number: MAX31856MUD+; Mouser Part Number: 700-MAX31856MUD+; Mouser Price/Stock: https://www.mouser.co.uk/ProductDetail/Analog-Devices-Maxim-Integrated/MAX31856MUD%2b?qs=sO%2FZ8XQFeM1TlxwAJsKRYw%3D%3D; Arrow Part Number: MAX31856MUD+; Arrow Price/Stock: https://www.arrow.com/en/products/max31856mud/analog-devices?utm_currency=USD&region=nac

## Sheet TLM_002_SD.SchDoc: =DocumentName
size A4; Author: Nazar Lysenko/Andrii Antonenko; CompanyName: Scopa Industries LLC; Engineer: Nazar Lysenko / Andrii Antonenko; Organization: Scopa Industries LLC; Address1: Kyiv; Address2: Ukraine; Address3: https://www.scopa.industries/; Address4: oleksyi.y@scopa.industries; Revision: 1; SheetNumber: 6; SheetTotal: 11
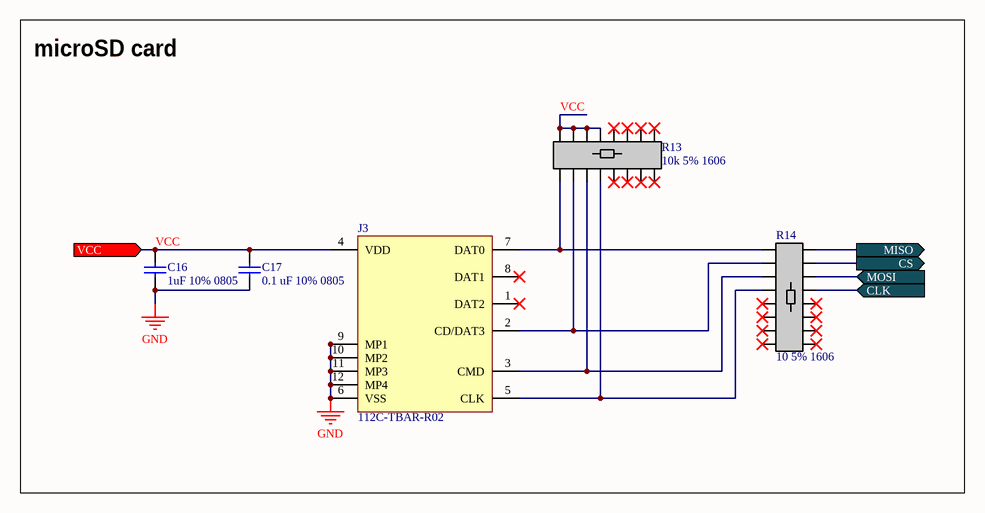
[diagram p6: TLM_002_SD.SchDoc]

### Parts
C16  1uF 10% 0805  [CAPC2013X145X50NL20T20]
C17  0.1 uF 10% 0805  [CAPC2013X140X50ML20T25]
J3  112C-TBAR-R02  [112CTBARR02]
R13  10k 5% 1606  [RES Array]
R14  10 5% 1606  [RES Array]

### Ports
CLK (in, see TLM_002_MBR[2C], TLM_002_CONNECT[1B], TLM_002_ESP32S3[2B], TLM_002_MAX6675[2B], TLM_002_MAX31856[2B]), CS (out, see TLM_002_MBR[2C]), MISO (out, see TLM_002_MBR[2B], TLM_002_CONNECT[1A], TLM_002_ESP32S3[3B], TLM_002_MAX6675[2B], TLM_002_MAX31856[2B]), MOSI (in, see TLM_002_MBR[2C], TLM_002_CONNECT[1A], TLM_002_ESP32S3[2B], TLM_002_MAX31856[2B]), VCC (in, see TLM_002_MBR[2B], TLM_002_DS3231SN_RTC[2B], TLM_002_ESP32S3[1A], TLM_002_INA228[1B], TLM_002_LoRa[2B], TLM_002_MAX6675[2B], TLM_002_MAX31856[1B], TLM_002_MCP3021[3B])

### Nets
GND: C16.1 C17.1 J3.6(VSS) J3.9(MP1) J3.10(MP2) J3.11(MP3) J3.12(MP4)
VCC: C16.2 C17.2 J3.4(VDD) R13.13 R13.14 R13.15 R13.16 ; port VCC  [project net -3V3_CTRL]
CLK: R14.13 ; port CLK
CS_SD: R14.15 ; port CS
MISO: R14.16 ; port MISO
MOSI: R14.14 ; port MOSI
NetJ3_2: J3.2(CD/DAT3) R13.2 R14.2
NetJ3_3: J3.3(CMD) R13.3 R14.3
NetJ3_5: J3.5(CLK) R13.4 R14.4
NetJ3_7: J3.7(DAT0) R13.1 R14.1

Not connected (* = marked no-connect by the designer): J3 1(DAT2)* 8(DAT1)*; R13 5* 6* 7* 8* 9* 10* 11* 12*; R14 5* 6* 7* 8* 9* 10* 11* 12*

### Notes on the sheet
- microSD card
- Title
- Size:
- Date:
- A4
- Author:
- Time:
- Sheet
- Revision:
- of
- File:

### Library data of the parts
C16 = CMP-2007-01676-1: as C5 on sheet TLM_002_MAX6675
C17 = CMP-2007-04651-1: as C6 on sheet TLM_002_MAX6675
J3 = 112C-TBAR-R02: Connector; Manufacturer_Name: ATTEND; Height: 2.13mm; Manufacturer_Part_Number: 112C-TBAR-R02
R13 = RES_ARRAY_10k
R14 = RES_ARRAY_10

## Sheet TLM_002_DS3231SN_RTC.SchDoc: =DocumentName
size A4; Author: Nazar Lysenko/Andrii Antonenko; CompanyName: Scopa Industries LLC; Engineer: Nazar Lysenko / Andrii Antonenko; Organization: Scopa Industries LLC; Address1: Kyiv; Address2: Ukraine; Address3: https://www.scopa.industries/; Address4: oleksyi.y@scopa.industries; Revision: 1; SheetNumber: 7; SheetTotal: 11
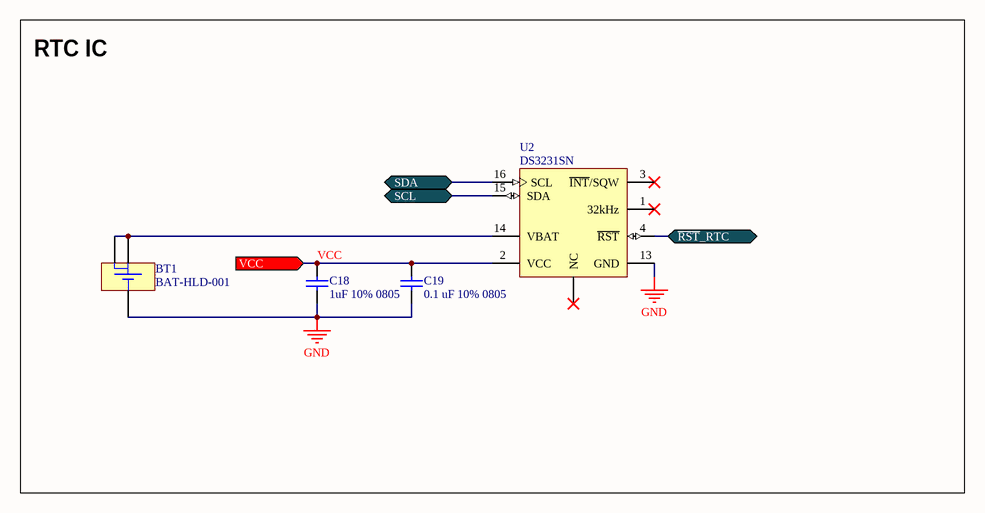
[diagram p7: TLM_002_DS3231SN_RTC.SchDoc]

### Parts
BT1  BAT-HLD-001  [BATHLD-001]
C18  1uF 10% 0805  [CAPC2013X145X50NL20T20]
C19  0.1 uF 10% 0805  [CAPC2013X140X50ML20T25]
U2  DS3231SN  [W16#H2_N]

### Ports
SCL (bidir, see TLM_002_MBR[2B], TLM_002_CONNECT[1B], TLM_002_ESP32S3[2B], TLM_002_INA228[2B], TLM_002_MCP3021[4B]), SDA (bidir, see TLM_002_MBR[2B], TLM_002_CONNECT[1B], TLM_002_ESP32S3[2B], TLM_002_INA228[2B], TLM_002_MCP3021[3B]), VCC (in, see TLM_002_MBR[2B], TLM_002_ESP32S3[1A], TLM_002_INA228[1B], TLM_002_LoRa[2B], TLM_002_MAX6675[2B], TLM_002_MAX31856[1B], TLM_002_MCP3021[3B], TLM_002_SD[1B]), ~{RST}_RTC (bidir, see TLM_002_MBR[2B], TLM_002_ESP32S3[3B])

### Nets
GND: BT1.1(-) C18.1 C19.1 U2.13(GND)
VCC: C18.2 C19.2 U2.2(VCC) ; port VCC  [project net -3V3_CTRL]
~{RST}_RTC: U2.4(~{RST}) ; port ~{RST}_RTC
SCL: U2.15(SDA) ; port SCL
SDA: U2.16(SCL) ; port SDA
NetBT1_2: BT1.2(+) BT1.3(+) U2.14(VBAT)

Not connected (* = marked no-connect by the designer): U2 1(32kHz)* 3(~{INT}/SQW)* 5(NC)*

### Notes on the sheet
- RTC IC DS3231
- Title
- Size:
- Date:
- A4
- Author:
- Time:
- Sheet
- Revision:
- of
- File:

### Library data of the parts
BT1 = CMP-0168-00043-1: 20mm Coin Cell Battery Holder; PCB_Layout: Complies with manufacturer's recommendation.; DatasheetVersion: rev1.0, Dec-2007; PackageVersion: rev1.0, Dec-2007; PackageReference: BATHLD-001; PackageDescription: Low Profile SM Battery Holder, 20mm Lithium Cell, 21.1 x 15.3 x 4.2 mm Body
C18 = CMP-2007-01676-1: as C5 on sheet TLM_002_MAX6675
C19 = CMP-2007-04651-1: as C6 on sheet TLM_002_MAX6675
U2 = CMP-00003-1: DS3231 Series 5.5 V Extremely Accurate I2C-Integrated RTC/TCXO/Crystal - SOIC-16; Manufacturer Lifecycle Status: PRODUCTION; Time Format: HH:MM:SS; Operating Supply Voltage: 3.3V; Min Supply Voltage: 2.3V; Date Format: YY-MM-DD-dd; Interface: I2C; Logic Function: Clock; Frequency: 32.768kHz; Max Supply Voltage: 5.5V; Number of Outputs: 1; Pins: 16; Max Operating Temperature: 85°C; Radiation Hardening: No; Width: 7.6mm; Weight: 665.986997mg; Termination: SMD/SMT; Height: 2.35mm; Lifecycle Status: Production; Length: 10.5mm; Mounting Technology: Surface Mount; REACH SVHC: Unknown; Schedule B: 8542390000; Case/Package: SOIC; Min Operating Temperature: -40°C; RoHS: Compliant; Lead Free: Lead Free

## Sheet TLM_002_SRC.SchDoc: =DocumentName
size A4; Author: Nazar Lysenko/Andrii Antonenko; CompanyName: Scopa Industries LLC; Engineer: Nazar Lysenko / Andrii Antonenko; Organization: Scopa Industries LLC; Address1: Kyiv; Address2: Ukraine; Address3: https://www.scopa.industries/; Address4: oleksyi.y@scopa.industries; Revision: 1; SheetNumber: 9; SheetTotal: 11
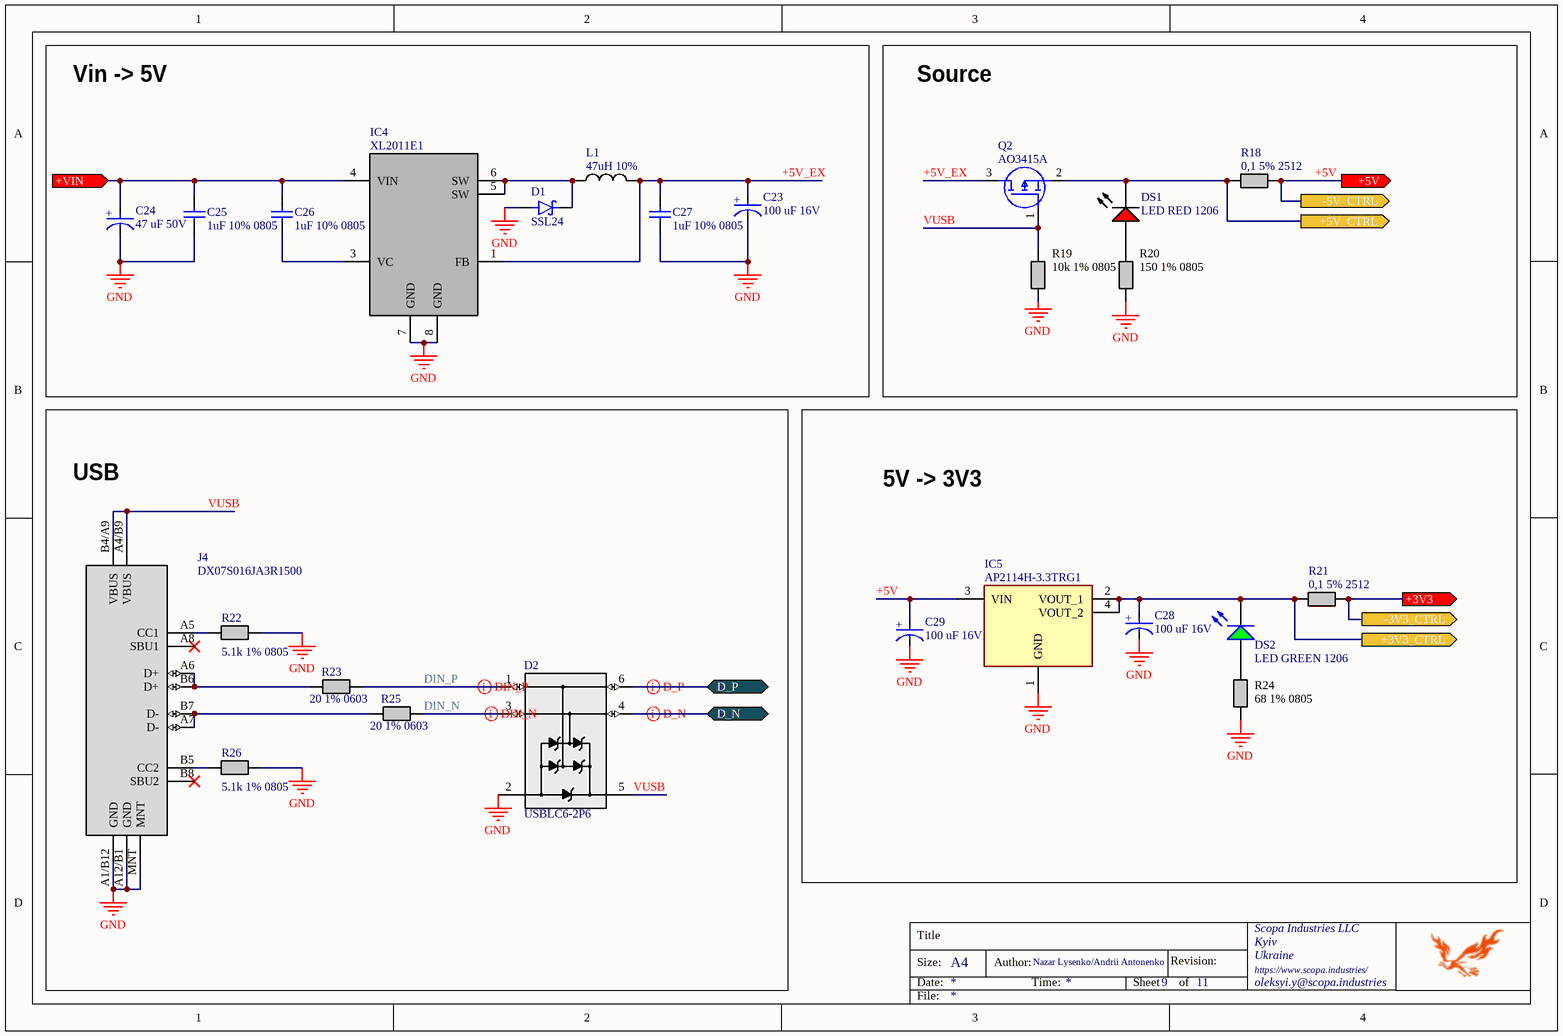
[diagram p8: TLM_002_SRC.SchDoc]

### Parts
C23  100 uF 16V  [FP-ZLG6_3X11-MFG]
C24  47 uF 50V  [FP-ZLG6_3X11-MFG]
C25  1uF 10% 0805  [CAPC2013X145X50NL20T20]
C26  1uF 10% 0805  [CAPC2013X145X50NL20T20]
C27  1uF 10% 0805  [CAPC2013X145X50NL20T20]
C28  100 uF 16V  [FP-ZLG6_3X11-MFG]
C29  100 uF 16V  [FP-ZLG6_3X11-MFG]
D1  SSL24  [DIO_SSL24]
D2  USBLC6-2P6  [FP-SOT-666-MFG]
DS1  LED RED 1206  [LUMX-SML-LX1206IC_V]
DS2  LED GREEN 1206  [LTST-C230KGKT_V]
IC4  XL2011E1  [SOIC127P600X175-8N]
IC5  AP2114H-3.3TRG1  [SOT230P700X180-4N]
J4  DX07S016JA3R1500  [FP-DX07S016JA3R1500-MFG]
L1  47uH 10%  [INDUCTOR 9MM]
Q2  AO3415A  [SOT95P280X125-3N]
R18  0,1 5% 2512  [RES_2512]
R19  10k 1% 0805  [RES_0805]
R20  150 1% 0805  [RES_0805]
R21  0,1 5% 2512  [RES_2512]
R22  5.1k 1% 0805  [RES_0805]
R23  20 1% 0603  [RES_0603]
R24  68 1% 0805  [RES_0805]
R25  20 1% 0603  [RES_0603]
R26  5.1k 1% 0805  [RES_0805]

### Ports
+3V3 (out, see TLM_002_MBR[2A], TLM_002_CONNECT[1A]), +3V3_CTRL (out, see TLM_002_MBR[2B]), +5V (out, see TLM_002_MBR[2A], TLM_002_CONNECT[1A]), +5V_CTRL (out, see TLM_002_MBR[2A]), +VIN (in, see TLM_002_MBR[1A]), -3V3_CTRL (out, see TLM_002_MBR[2B]), -5V_CTRL (out, see TLM_002_MBR[2B]), D_N (bidir, see TLM_002_MBR[2A], TLM_002_CONNECT[1B], TLM_002_ESP32S3[3A]), D_P (bidir, see TLM_002_MBR[2A], TLM_002_CONNECT[1B], TLM_002_ESP32S3[3A])

### Nets
+5V: C29.2(A) IC5.3(VIN) R18.1 ; port +5V, port -5V_CTRL
+VIN: C24.2(A) C25.2 C26.2 IC4.4(VIN) ; port +VIN
-3V3_CTRL: R21.1 ; port +3V3, port -3V3_CTRL
GND: C23.1(C) C24.1(C) C25.1 C27.1 C28.1(C) C29.1(C) D1.A D2.2(GND) IC4.7(GND) IC4.8(GND) IC5.1(GND) J4.A1/B12(GND) J4.A12/B1(GND) J4.MNT R19.2 R20.2 R22.1 R24.2 R26.1
+3V3_CTRL: C28.2(A) DS2.2(K) IC5.2(VOUT_1) IC5.4(VOUT_2) R21.2 ; port +3V3_CTRL
+5V_CTRL: DS1.2(K) Q2.2(S) R18.2 ; port +5V_CTRL
+5V_EX: C23.2(A) C27.2 IC4.1(FB) L1.2 Q2.3(D)
D_N: D2.4(I/O2) ; port D_N
D_P: D2.6(I/O1) ; port D_P
DIN_N: D2.3(I/O2) R25.2
DIN_P: D2.1(I/O1) R23.2
VUSB: D2.5(VBUS) J4.A4/B9(VBUS) J4.B4/A9(VBUS) Q2.1(G) R19.1
NetC26_1: C26.1 IC4.3(VC)
NetD1_C: D1.C(K) IC4.5(SW) IC4.6(SW) L1.1
NetDS1_1: DS1.1(A) R20.1
NetDS2_1: DS2.1(A) R24.1
NetJ4_A5: J4.A5(CC1) R22.2
NetJ4_A6: J4.A6(D+) J4.B6(D+) R23.1
NetJ4_A7: J4.A7(D-) J4.B7(D-) R25.1
NetJ4_B5: J4.B5(CC2) R26.2

Not connected (* = marked no-connect by the designer): J4 A8(SBU1)* B8(SBU2)*

### Layout directives
differential pair: D_N, D_P, DIN_N, DIN_P

### Notes on the sheet
- Vin -> 5V
- Source switching
- USB
- 5V -> 3V3
- Title
- Size:
- Date:
- A4
- Author:
- Time:
- Sheet
- Revision:
- of
- File:
- (in symbol CMP-35376-000012-1) +

### Library data of the parts
C23 C28 C29 = CMP-35376-000012-1: CAP ALUM 100UF 16V RADIAL; Dielectric Material: Aluminium; Tolerance: 20%; Impedance: 65mR; Ripple Current: 760mA; Life (Hours): 2000Hour; Case/Package: Radial; Capacitance: 100uF; Diameter: 6.3mm; Min Operating Temperature: -40°C; Packaging: Bulk; Max Operating Temperature: 105°C; Height: 11mm; Radiation Hardening: No; Series: ZLG; Voltage Rating: 16V; Lead Pitch: 2.5mm; Lead Free: Lead Free; Height - Seated (Max): 0.492inch; Mount: Through Hole; Package Quantity: 3000; Termination: Radial; RoHS Compliant: Yes
C24 = CMP-35376-000012-1: CAP ALUM 47UF 50V RADIAL; Dielectric Material: Aluminium; Tolerance: 20%; Impedance: 65mR; Ripple Current: 760mA; Voltage Rating: 16V; Life (Hours): 2000Hour; Case/Package: Radial; Capacitance: 47uF; Diameter: 6.3mm; Min Operating Temperature: -40°C; Packaging: Bulk; Max Operating Temperature: 105°C; Height: 11mm; Radiation Hardening: No; Series: ZLG; Lead Pitch: 2.5mm; Lead Free: Lead Free; Height - Seated (Max): 0.492inch; Mount: Through Hole; Package Quantity: 3000; Termination: Radial; RoHS Compliant: Yes
C25-C27 = CMP-2007-01676-1: as C5 on sheet TLM_002_MAX6675
D1 = SSL24: 2A, 40V, Schottky Rectifier; MF: Taiwan Semiconductor; SnapEDA_Link: https://www.snapeda.com/parts/SSL24/taiwan/view-part/?ref=snap; Package: SMB-2 Taiwan Semiconductor; Value: *; MP: SSL24; Check_prices: https://www.snapeda.com/parts/SSL24/taiwan/view-part/?ref=eda
D2 = CMP-00001-1: ESD Suppressors / TVS Diodes High Speed Interface Protection Low Cap; Leakage Current: 150nA; Number of Channels: 2; Direction: Unidirectional; Power Line Protection: Yes; Forward Voltage: 1.1V; Max Breakdown Voltage: 6V; Value: 2.5pF; Test Current: 1mA; Reverse Standoff Voltage: 5V; Number of Elements: 1; Max Junction Temperature (Tj): 125°C; Peak Pulse Current: 5A; Max Repetitive Reverse Voltage (Vrrm): 5.25V; Clamping Voltage: 17V; Element Configuration: Dual; Lifecycle Status: Production; Max Operating Temperature: 125°C; Number of Terminals: 6; RoHS: Compliant; Termination: SMD/SMT; Contact Plating: Tin; Depth: 1.3mm; Number of Bidirectional Channels: 2; Max Reverse Leakage Current: 150nA; Breakdown Voltage: 6V; Width: 1.3mm; Lead Free: Lead Free; Min Operating Temperature: -40°C; REACH SVHC: Yes; ESD Protection: Yes; Peak Reverse Current: 150nA; China RoHS: Compliant; Mounting Technology: Surface Mount; Height: 600µm; Reverse Breakdown Voltage: 6V; Case/Package: SOT-666; Schedule B: 8536300000, 8536300000; Radiation Hardening: No; Length: 1.7mm; Working Voltage: 5V; Min Breakdown Voltage: 6V; Pins: 6; Polarity: Unidirectional
DS1 = CMP-2000-07123-1: LED Red, 65 mW, -40 to 85 degC, 2-Pin SMD, RoHS, Tape and Reel; Manufacturer: Lumex; Part No: SML-LX1206IC-TR; LED Material: GaAsP; Peak Wavelength: 635nm; Number of LEDs: 1; Viewing Angle: 160; Reverse Voltage: 5(Min)V; Lens Appearance: ColorlessNonDiffused; Intensity: 6mcd; Type: Uni-Color; Pin_Count: 2; Lens Dimensions: 2x1.6x0.5mm; Mounting: SurfaceMount; ECCN: EAR99; RoHS: Unknown; Package Description: 2-Pin Surface Mount Device, Body 3.2 x 1.5 mm; Mounting Technology: SurfaceMount; Dominant Wavelength: N/A; Supplier_Package: SMD; Supplier Standard Pack: 3,000; Color: Red; Dimension: 3.2x1.6x1.1mm; HTS: 8541402000; Family: SML-LX1206IC; Supplier: Lumex; Datasheet URL: http://www.lumex.com/content/files/ProductAttachment/SML-LX1206IC-TR.pdf; Package Reference: SML-LX1206IC; Manufacturer URL: http://www.lumexinstruments.com/; Operating Temperature: -25to85C; Packaging: TapeandReel; Datasheet Version: Rev. J, 08/2012
DS2 = CMP-2000-06625-1: LED Green, 75 mW, 30 mA, -30 to 85 degC, 2-Pin SMD, RoHS, Tape and Reel; Manufacturer: Lite-On; Product Length (mm): 3.2mm; Type: Uni-Color; Peak Wavelength: 574nm; Shape Type: Rectangular; DELETED: Compliant; Lum Intensity: 35mcd; Forward Voltage: 2.4V; High Brightness: Yes; Rad Hardened: No; Power Dissipation: 75W; Forward Current: 30mA; Emitting Color: YellowGreen; Main Category: ChipLED; Product Height (mm): 1.1mm; Product Depth (mm): 1.6mm; Number of  Elements: 1; Viewing Angle: 130deg; Chip Material: AlGaInP; Dominant Wave Length: 571nm; Test Current (It): 20mA; Reverse Voltage: 5V; Mounting: SurfaceMount; Datasheet URL: http://optoelectronics.liteon.com/upload/download/DS22-2000-256/S_110_LTST-C230KGKT.pdf; Luminous Intensity: 35mcd; Pin Count: 2; Mounting Technology: SurfaceMount; Operating Temperature Classification: Industrial; Operating Temp Range: -55Cto85C; Package Type: ChipLed; Manufacturer URL: http://www.us.liteon.com/; Package Description: 2-Pin Surface Mount Device, Body 3.2 x 1.6 mm; Package Reference: C230KGKT; Datasheet Version: Rev. G, 12/2014; Lens Dimensions: 1.5X1.6X0.82mm; Packaging: TapeandReel
IC4 = XL2011E1: Integrated Circuit; Manufacturer_Name: Texas Instruments; Manufacturer_Part_Number: NE555DR; Datasheet Link: http://www.ti.com/lit/ds/symlink/ne555.pdf; Height: 1.75mm; Mouser Part Number: 595-NE555DR; Mouser Price/Stock: https://www.mouser.com/Search/Refine.aspx?Keyword=595-NE555DR; RS Part Number: 1218414; RS Price/Stock: http://uk.rs-online.com/web/p/products/1218414
IC5 = AP2114H-3.3TRG1: Integrated Circuit; Manufacturer_Name: Diodes Incorporated; Datasheet Link: https://www.diodes.com//assets/Datasheets/AP2114.pdf; Height: 1.8mm; Manufacturer_Part_Number: AP2114H-3.3TRG1; Mouser Part Number: 621-AP2114H-3.3TRG1; Mouser Price/Stock: https://www.mouser.co.uk/ProductDetail/Diodes-Incorporated/AP2114H-3.3TRG1?qs=x6A8l6qLYDDSG%2FfwzcsOhw%3D%3D; Arrow Part Number: AP2114H-3.3TRG1; Arrow Price/Stock: https://www.arrow.com/en/products/ap2114h-3.3trg1/diodes-incorporated?utm_currency=USD&region=nac
J4 = CMP-00000-2: Receptacle, 16 Position, 1-Row SMT, without Rear Shield, Shell-DIP Length 1.2mm; Number of Contacts: 16; USB Standard: USB 2.0; Voltage Rating: 20V; Current Rating: 6.25A; Lifecycle Status: Production; Min Operating Temperature: -40°C; Contact Material: Gold, Nickel; Height: 3.31mm; Max Operating Temperature: 85°C; REACH SVHC: Yes; RoHS: Compliant
L1 = Inductor_470k
Q2 = AO3415A: MOSFET (P-Channel); Manufacturer_Name: Alpha & Omega Semiconductors; Datasheet Link: http://www.aosmd.com/pdfs/datasheet/AO3415A.pdf; Height: 1.25mm; Manufacturer_Part_Number: AO3415A; Arrow Part Number: AO3415A; Arrow Price/Stock: https://www.arrow.com/en/products/ao3415a/alpha-and-omega-semiconductor?utm_currency=USD&region=europe
R18 R21 = Resistor_0,1: Resistor 0,1 Ohm 5% SMD 2512 Generic; Tolerance: 1%; Value: 10k; Package size: 0805
R19 = Resistor_10k: Resistor 10kOhm 1% SMD 0805 Generic; Package size: 0805; Tolerance: 1%; Value: 10k
R20 = Resistor_10k: Resistor 150 Ohm 1% SMD 0805 Generic; Value: 150; Package size: 0805; Tolerance: 1%
R22 R26 = Resistor_1k: Resistor 5.1kOhm 1% SMD 0805 Generic; Package size: 0805; Tolerance: 1%; Value: 5.1k
R23 R25 = Resistor_20: as R2 on sheet TLM_002_ESP32S3; Package size: 0805; Tolerance: 1%
R24 = Resistor_10k: Resistor 68 Ohm 1% SMD 0805 Generic; Value: 68; Package size: 0805; Tolerance: 1%

## Sheet TLM_002_LoRa.SchDoc: =DocumentName
size A4; Author: Nazar Lysenko/Andrii Antonenko; CompanyName: Scopa Industries LLC; Engineer: Nazar Lysenko / Andrii Antonenko; Organization: Scopa Industries LLC; Address1: Kyiv; Address2: Ukraine; Address3: https://www.scopa.industries/; Address4: oleksyi.y@scopa.industries; Revision: 1; SheetNumber: 10; SheetTotal: 11
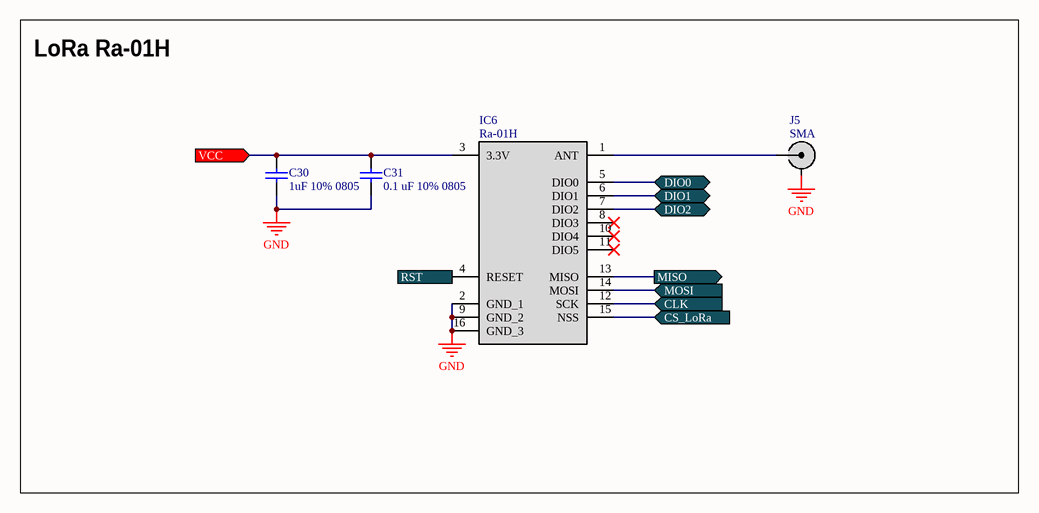
[diagram p9: TLM_002_LoRa.SchDoc]

### Parts
C30  1uF 10% 0805  [CAPC2013X145X50NL20T20]
C31  0.1 uF 10% 0805  [CAPC2013X140X50ML20T25]
IC6  Ra-01H  [Ra01H]
J5  SMA  [FP-5-1814400-2-MFG]

### Ports
CLK (in, see TLM_002_MBR[2A]), CS_LoRa (in, see TLM_002_MBR[2A]), DIO0 (bidir, see TLM_002_MBR[2A]), DIO1 (bidir, see TLM_002_MBR[2B]), DIO2 (bidir, see TLM_002_MBR[2B]), MISO (out, see TLM_002_MBR[2A]), MOSI (in, see TLM_002_MBR[2A]), RST (in, see TLM_002_MBR[2B]), VCC (in, see TLM_002_MBR[2A], TLM_002_DS3231SN_RTC[2B], TLM_002_ESP32S3[1A], TLM_002_INA228[1B], TLM_002_MAX6675[2B], TLM_002_MAX31856[1B], TLM_002_SD[1B])

### Nets
-3V3_CTRL: C30.2 C31.2 IC6.3(3.3V) ; port VCC
GND: C30.1 C31.1 IC6.2(GND_1) IC6.9(GND_2) IC6.16(GND_3) J5.2
LoRa_CLK: IC6.12(SCK) ; port CLK
LoRa_CS: IC6.15(NSS) ; port CS_LoRa
LoRa_DIO0: IC6.5(DIO0) ; port DIO0
LoRa_DIO1: IC6.6(DIO1) ; port DIO1
LoRa_DIO2: IC6.7(DIO2) ; port DIO2
LoRa_MISO: IC6.13(MISO) ; port MISO
LoRa_MOSI: IC6.14(MOSI) ; port MOSI
LoRa_RST: IC6.4(RESET) ; port RST
NetIC6_1: IC6.1(ANT) J5.1

Not connected (* = marked no-connect by the designer): IC6 8(DIO3)* 10(DIO4)* 11(DIO5)*

### Notes on the sheet
- LoRa Ra-01H
- Title
- Size:
- Date:
- A4
- Author:
- Time:
- Sheet
- Revision:
- of
- File:

### Library data of the parts
C30 = CMP-2007-01676-1: as C5 on sheet TLM_002_MAX6675
C31 = CMP-2007-04651-1: as C6 on sheet TLM_002_MAX6675
IC6 = Ra-01H: Integrated Circuit; Manufacturer_Name: Ai-Thinker; Datasheet Link: https://cdn.ozdisan.com/ETicaret_Dosya/632831_134737.pdf; Height: 3.4mm; Manufacturer_Part_Number: Ra-01H
J5 = CMP-00002-2: RF SMA Connector, 1 Contact(s), Female, Board Mount, Solder Terminal, Locking, Jack; Manufacturer Lifecycle Status: ACTIVE; Voltage Rating: 500V; Shielding: No; Impedance: 50Ω; Number of Contacts: 1; Dielectric Material: PTFE; Frequency: 3GHz; Lifecycle Status: Production; Max Operating Temperature: 85°C; RoHS: Compliant; China RoHS: Non-Compliant; Contact Gender: Female; Packaging: Tape & Reel; Schedule B: 8536694040, 8536694040; Number of Ports: 1; REACH SVHC: No; Contact Material: Gold; Min Operating Temperature: -55°C; Pins: 1; Height: 10.83mm; Number of Positions: 1